# Altium schematic sheet Signals.SchDoc: Signals.SchDoc
size A4; DocumentNumber: 2; SheetNumber: 1; SheetTotal: 4
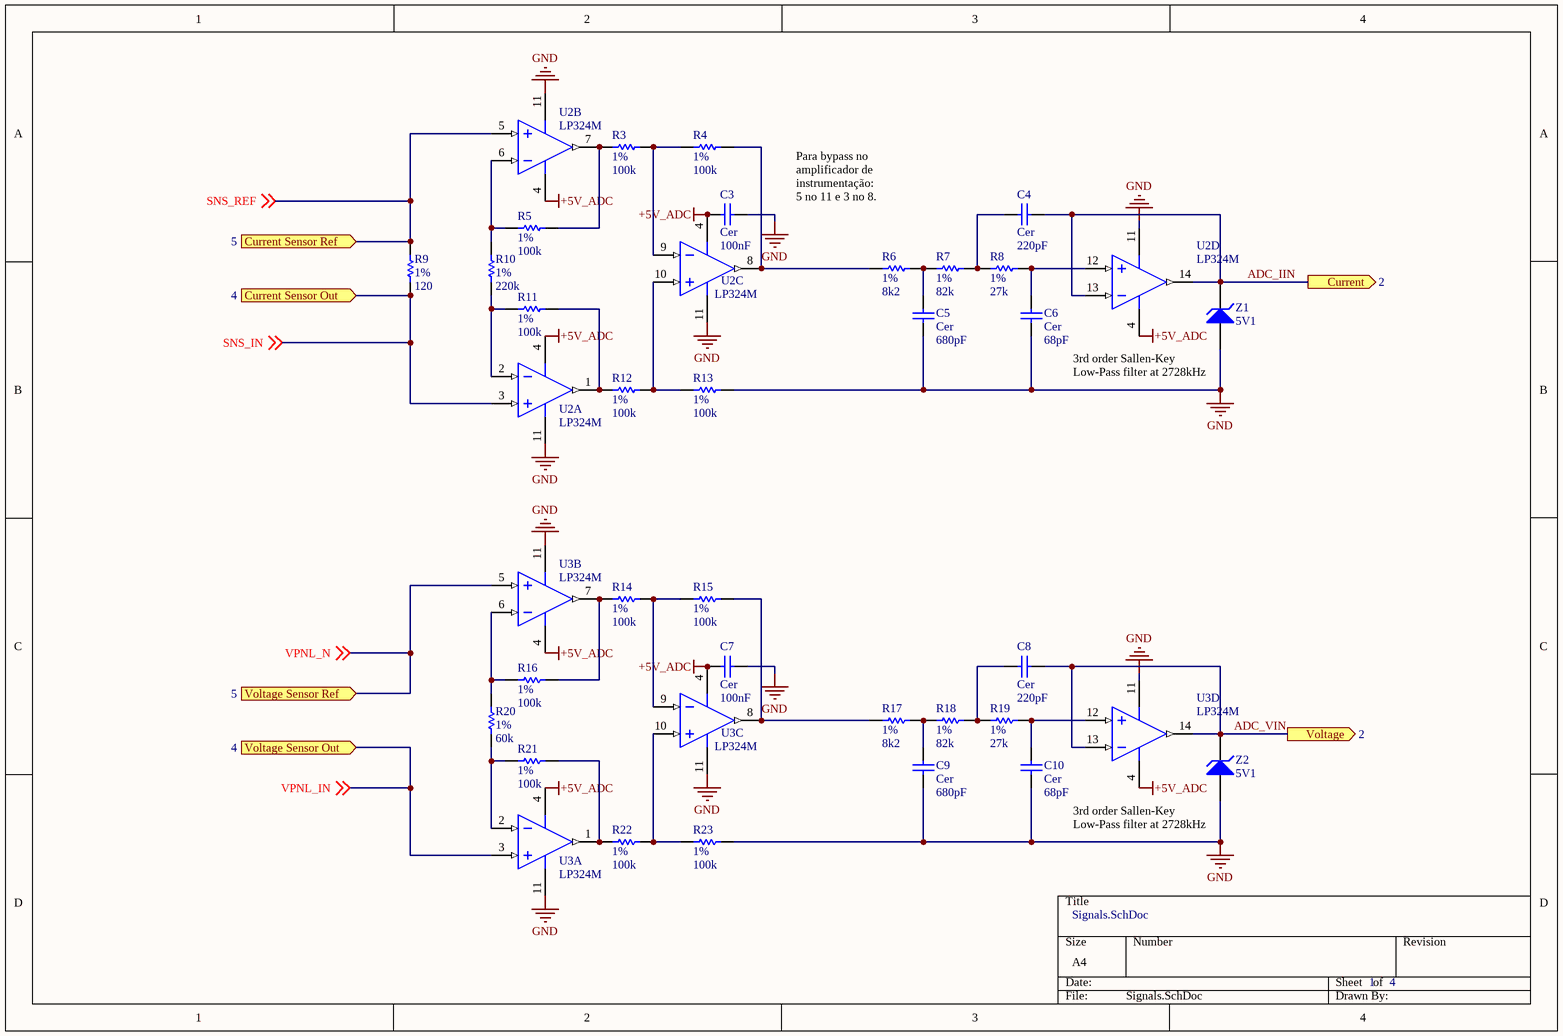
[diagram p0: Signals.SchDoc]

## Parts
C3  Cer  value 100nF  [C1210_M]
C4  Cer  value 220pF  [6-0805_M]
C5  Cer  value 680pF  [6-0805_M]
C6  Cer  value 68pF  [6-0805_M]
C7  Cer  value 100nF  [C1210_M]
C8  Cer  value 220pF  [6-0805_M]
C9  Cer  value 680pF  [6-0805_M]
C10  Cer  value 68pF  [6-0805_M]
R3  1%  value 100k  [6-0805_M]
R4  1%  value 100k  [6-0805_M]
R5  1%  value 100k  [6-0805_M]
R6  1%  value 8k2  [6-0805_M]
R7  1%  value 82k  [6-0805_M]
R8  1%  value 27k  [6-0805_M]
R9  1%  value 120  [6-0805_M]
R10  1%  value 220k  [6-0805_M]
R11  1%  value 100k  [6-0805_M]
R12  1%  value 100k  [6-0805_M]
R13  1%  value 100k  [6-0805_M]
R14  1%  value 100k  [6-0805_M]
R15  1%  value 100k  [6-0805_M]
R16  1%  value 100k  [6-0805_M]
R17  1%  value 8k2  [6-0805_M]
R18  1%  value 82k  [6-0805_M]
R19  1%  value 27k  [6-0805_M]
R20  1%  value 60k  [6-0805_M]
R21  1%  value 100k  [6-0805_M]
R22  1%  value 100k  [6-0805_M]
R23  1%  value 100k  [6-0805_M]
U2  LP324M  [M14A_M]  (parts A,B,C,D of 4)
U3  LP324M  [M14A_M]  (parts A,B,C,D of 4)
Z1  5V1  [C1210_M]
Z2  5V1  [C1210_M]

## Ports
Current (out, see 2), Current Sensor Out (in, see 4), Current Sensor Ref (in, see 5), Voltage (out, see 2), Voltage Sensor Out (in, see 4), Voltage Sensor Ref (in, see 5)

## Nets
+5V_ADC: C3.2 C7.2 U2.4(V+) U3.4(V+)
GND: C3.1 C5.1 C6.1 C7.1 C9.1 C10.1 R13.1 R23.1 U2.11(GND) U3.11(GND) Z1.1(A) Z2.1(A)
ADC_IIN: C4.2 U2.13(IN4-) U2.14(OUT4) Z1.2(K) ; port Current
ADC_VIN: C8.2 U3.13(IN4-) U3.14(OUT4) Z2.2(K) ; port Voltage
SNS_IN: R9.1 U2.3(IN1+) ; off-sheet SNS_IN, port Current Sensor Out
SNS_REF: R9.2 U2.5(IN2+) ; off-sheet SNS_REF, port Current Sensor Ref
VPNL_IN: U3.3(IN1+) ; off-sheet VPNL_IN, port Voltage Sensor Out
VPNL_N: U3.5(IN2+) ; off-sheet VPNL_N, port Voltage Sensor Ref
NetC4_1: C4.1 R7.1 R8.2
NetC5_2: C5.2 R6.1 R7.2
NetC6_2: C6.2 R8.1 U2.12(IN4+)
NetC8_1: C8.1 R18.1 R19.2
NetC9_2: C9.2 R17.1 R18.2
NetC10_2: C10.2 R19.1 U3.12(IN4+)
NetR3_1: R3.1 R4.2 U2.9(IN3-)
NetR3_2: R3.2 R5.2 U2.7(OUT2)
NetR4_1: R4.1 R6.2 U2.8(OUT3)
NetR5_1: R5.1 R10.2 U2.6(IN2-)
NetR10_1: R10.1 R11.2 U2.2(IN1-)
NetR11_1: R11.1 R12.2 U2.1(OUT1)
NetR12_1: R12.1 R13.2 U2.10(IN3+)
NetR14_1: R14.1 R15.2 U3.9(IN3-)
NetR14_2: R14.2 R16.2 U3.7(OUT2)
NetR15_1: R15.1 R17.2 U3.8(OUT3)
NetR16_1: R16.1 R20.2 U3.6(IN2-)
NetR20_1: R20.1 R21.2 U3.2(IN1-)
NetR21_1: R21.1 R22.2 U3.1(OUT1)
NetR22_1: R22.1 R23.2 U3.10(IN3+)

## Notes on the sheet
- Para bypass no amplificador de instrumentação:
  5 no 11 e 3 no 8.
- 3rd order Sallen-Key Low-Pass filter at 2728kHz

## Library data of the parts
C3-C10 = Cap: Capacitor; Published: 8-Jun-2000; LatestRevisionDate: 17-Jul-2002; LatestRevisionNote: Re-released for DXP Platform.; PackageReference: RAD-0.3; Publisher: Altium Limited; PackageDescription: Radial Cap, Thru-Hole; 2 Leads; 0.3 in Pin Spacing
R3-R23 = Res1: Resistor; Published: 8-Jun-2000; LatestRevisionDate: 17-Jul-2002; LatestRevisionNote: Re-released for DXP Platform.; PackageReference: AXIAL-0.3; Publisher: Altium Limited; PackageDescription: Axial Device, Thru-Hole; 2 Leads; 0.3 in Pin Spacing
U2 U3 = LP324M: Micropower Quad Operational Amplifier; Manufacturer: National Semiconductor; CompType: Amplifiers; PackageTopMarking: NSUZXYTT*LP324M; PowerWise: N; Published: 4-Dec-2008; DatasheetVersion: Jul-2001; PackageVersion: revJ, Jan-1996; PackageReference: M14A; Publisher: Altium Limited; PackageDescription: Molded Package S.O., .150in Wide, 14 Lead; PartNumber: LP324M; RoHS: O; PinCount: 14; DigiKeyPartNumber: LP324MXCT-ND; Code_JEDEC: MS-012AB; Code_IPC: SOIC127P600-14; ComponentLink1Description: LP324 Datasheet; ComponentLink1URL: http://www.national.com/ds/LP/LP324.pdf; ComponentLink2Description: LP324 Web Page; ComponentLink2URL: http://www.national.com/pf/LP/LP324.html; ComponentLink3Description: M14A Package Page; ComponentLink3URL: http://www.national.com/packaging/folders/m14a.html
Z1 Z2 = D Zener: Zener Diode; Published: 8-Jun-2000; LatestRevisionDate: 17-Jul-2002; LatestRevisionNote: Re-released for DXP Platform.; PackageReference: DIODE-0.7; Publisher: Altium Limited; PackageDescription: Diode, Thru-Hole; 2 Leads; 0.7 in Pin Spacing